# Altium schematic sheet Tube_Driver.SchDoc
size A2; SheetNumber: 1; SheetTotal: 1
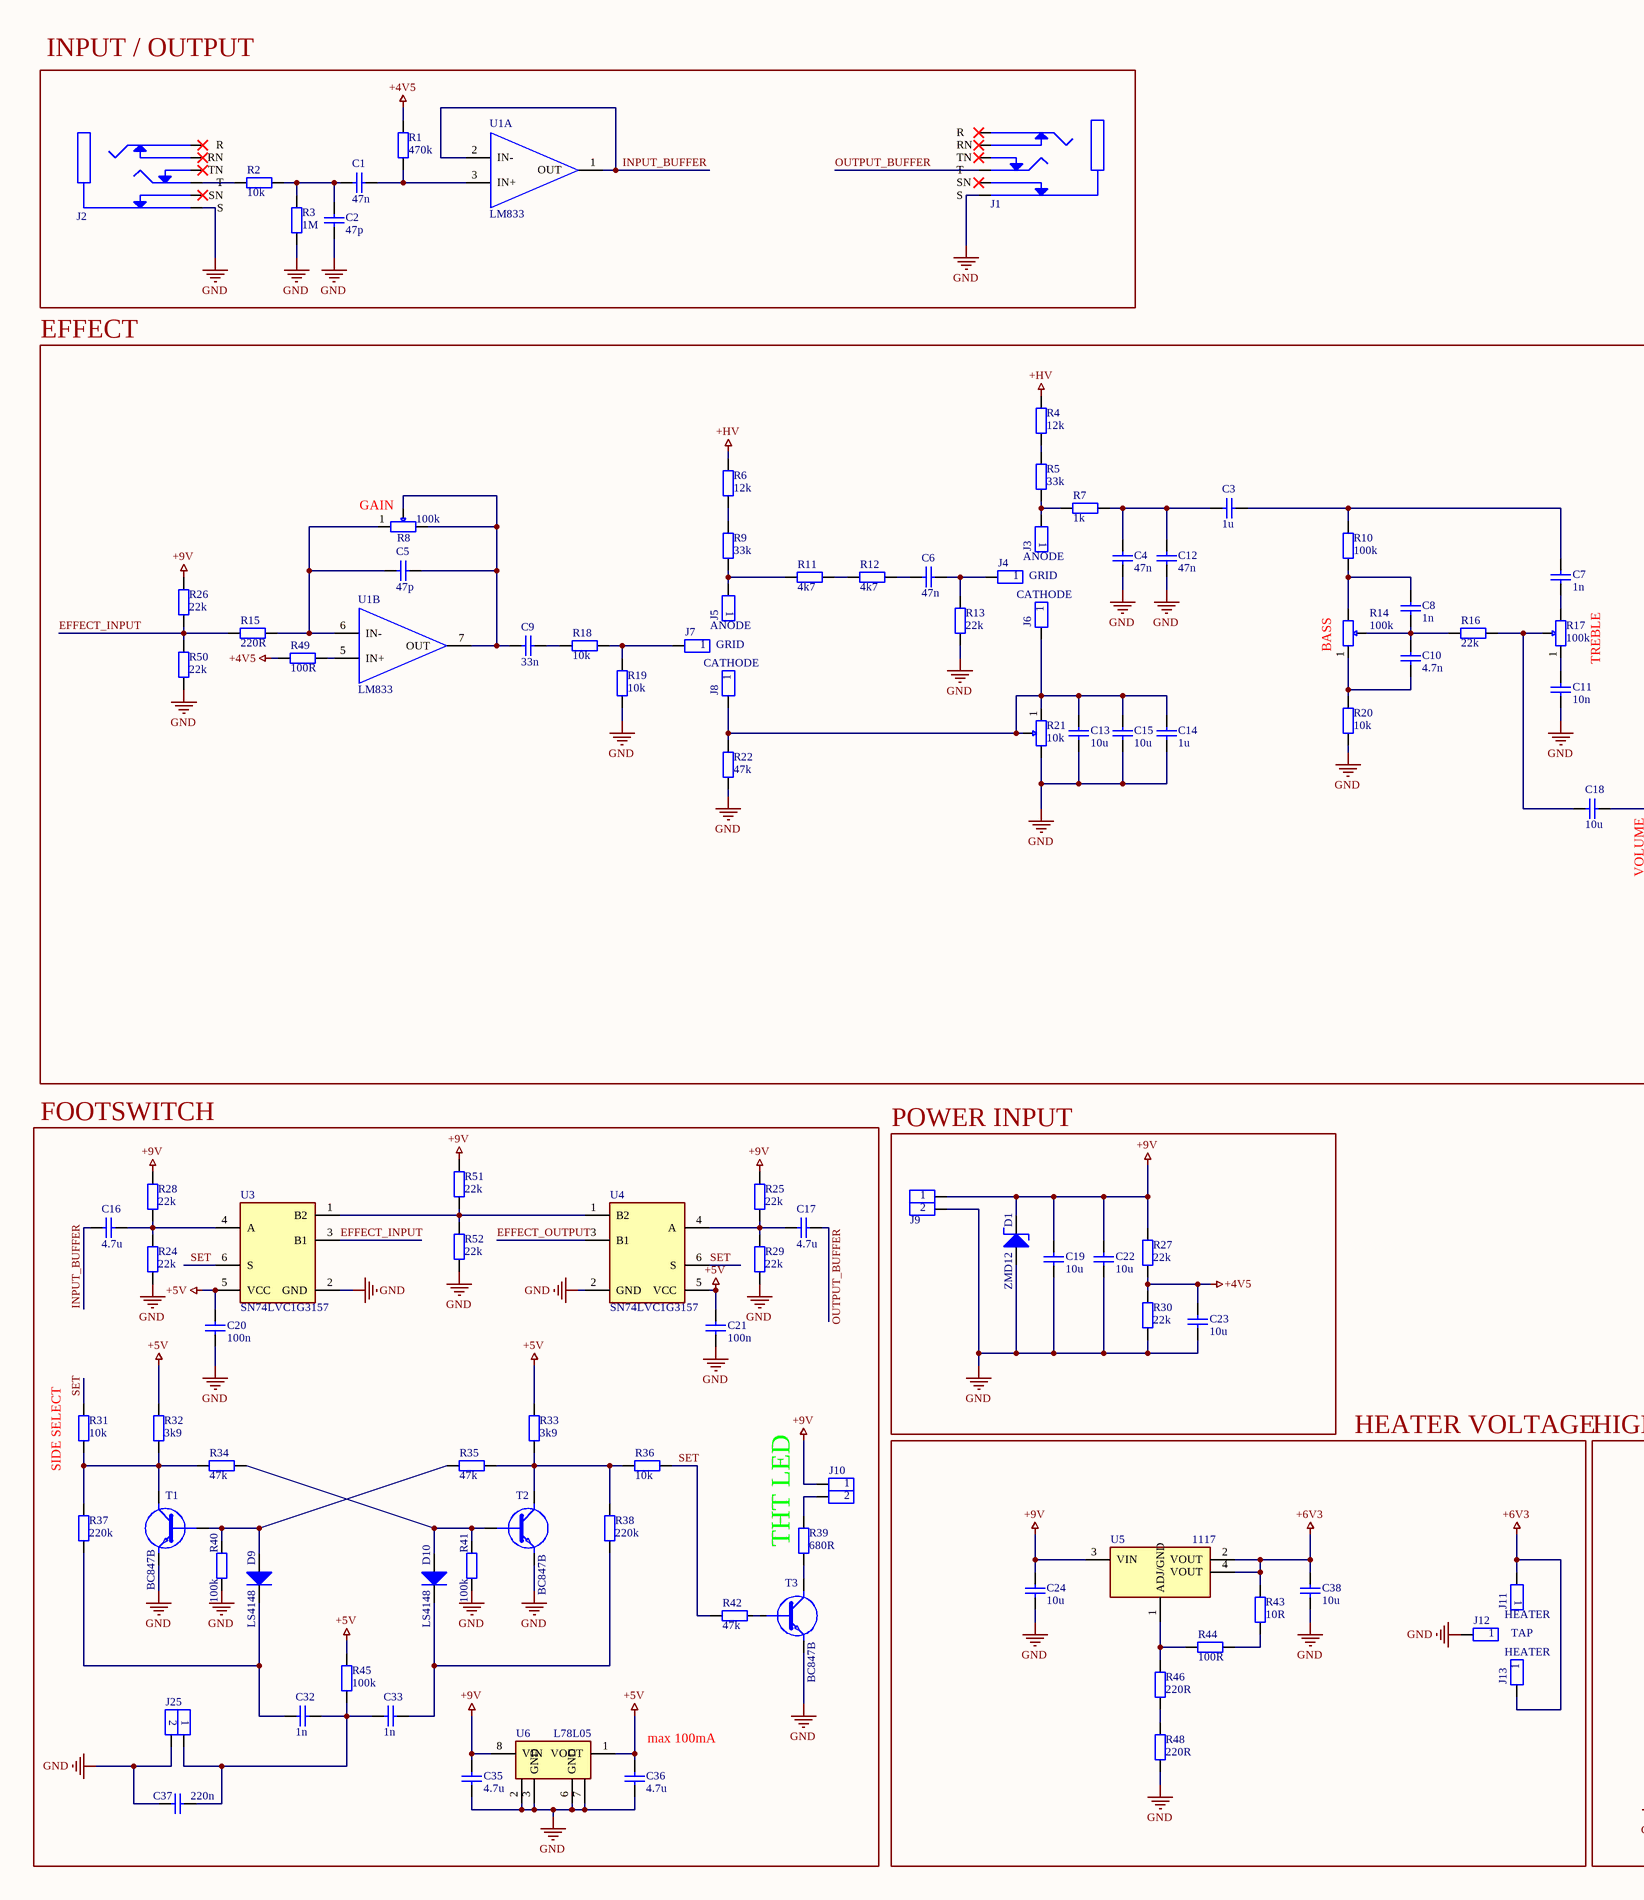
[diagram p0: Tube_Driver.SchDoc, left]
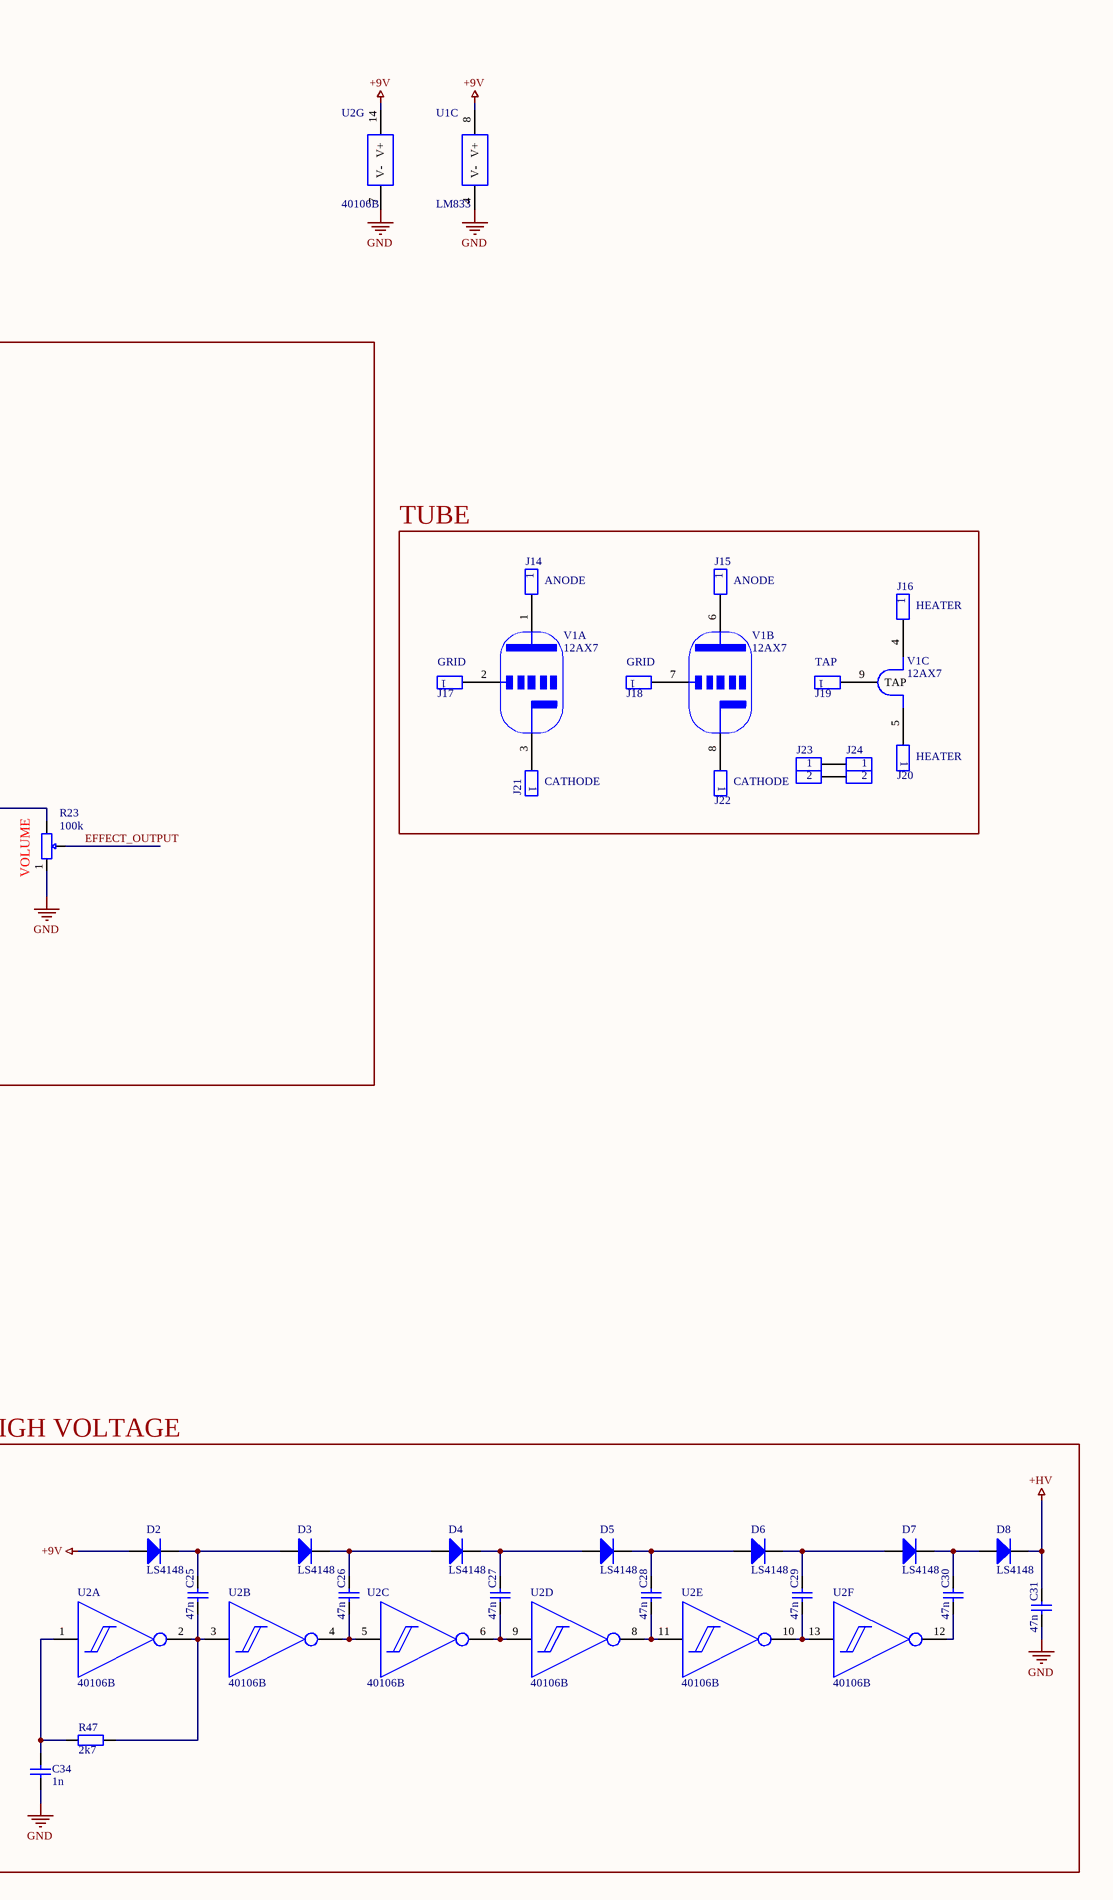
[diagram p1: Tube_Driver.SchDoc, right]

## Parts
C1  47n  [CAPACITOR 0805]
C2  47p  [CAPACITOR 0805]
C3  1u  [CAPACITOR 1206]
C4  47n  [CAPACITOR 1206]
C5  47p  [CAPACITOR 0805]
C6  47n  [CAPACITOR 1206]
C7  1n  [CAPACITOR 0805]
C8  1n  [CAPACITOR 0805]
C9  33n  [CAPACITOR 0805]
C10  4.7n  [CAPACITOR 0805]
C11  10n  [CAPACITOR 0805]
C12  47n  [CAPACITOR 1206]
C13  10u  [CAPACITOR 0805]
C14  1u  [CAPACITOR 0805]
C15  10u  [CAPACITOR 0805]
C16  4.7u  [CAPACITOR 0805]
C17  4.7u  [CAPACITOR 0805]
C18  10u  [CAPACITOR 0805]
C19  10u  [CAPACITOR 0805]
C20  100n  [CAPACITOR 0805]
C21  100n  [CAPACITOR 0805]
C22  10u  [CAPACITOR 0805]
C23  10u  [CAPACITOR 0805]
C24  10u  [CAPACITOR 0805]
C25  47n  [CAPACITOR 1206]
C26  47n  [CAPACITOR 1206]
C27  47n  [CAPACITOR 1206]
C28  47n  [CAPACITOR 1206]
C29  47n  [CAPACITOR 1206]
C30  47n  [CAPACITOR 1206]
C31  47n  [CAPACITOR 1206]
C32  1n  [CAPACITOR 0805]
C33  1n  [CAPACITOR 0805]
C34  1n  [CAPACITOR 0805]
C35  4.7u  [CAPACITOR 0805]
C36  4.7u  [CAPACITOR 0805]
C37  220n  [CAPACITOR 0805]
C38  10u  [CAPACITOR 0805]
D1  ZMD12  [DIODE SOD-80 DO-231AA]
D2  LS4148  [DIODE SOD-80 DO-231AA]
D3  LS4148  [DIODE SOD-80 DO-231AA]
D4  LS4148  [DIODE SOD-80 DO-231AA]
D5  LS4148  [DIODE SOD-80 DO-231AA]
D6  LS4148  [DIODE SOD-80 DO-231AA]
D7  LS4148  [DIODE SOD-80 DO-231AA]
D8  LS4148  [DIODE SOD-80 DO-231AA]
D9  LS4148  [DIODE SOD-80 DO-231AA]
D10  LS4148  [DIODE SOD-80 DO-231AA]
J1  ACJM-IH  [AMPHENOL ACJM-MHDR]  (value not drawn)
J2  ACJM-IH  [AMPHENOL ACJM-MHDR]  (value not drawn)
J3  901200761  [MECHANICAL PINHEADER 1P 2.54MM MALE]  (value not drawn)
J4  901200761  [MECHANICAL PINHEADER 1P 2.54MM MALE]  (value not drawn)
J5  901200761  [MECHANICAL PINHEADER 1P 2.54MM MALE]  (value not drawn)
J6  901200761  [MECHANICAL PINHEADER 1P 2.54MM MALE]  (value not drawn)
J7  901200761  [MECHANICAL PINHEADER 1P 2.54MM MALE]  (value not drawn)
J8  901200761  [MECHANICAL PINHEADER 1P 2.54MM MALE]  (value not drawn)
J9  901200762  [MECHANICAL PINHEADER 2P 2.54MM MALE]  (value not drawn)
J10  901200762  [MECHANICAL PINHEADER 2P 2.54MM MALE]  (value not drawn)
J11  901200761  [MECHANICAL PINHEADER 1P 2.54MM MALE]  (value not drawn)
J12  901200761  [MECHANICAL PINHEADER 1P 2.54MM MALE]  (value not drawn)
J13  901200761  [MECHANICAL PINHEADER 1P 2.54MM MALE]  (value not drawn)
J14  901200761  [MECHANICAL PINHEADER 1P 2.54MM MALE]  (value not drawn)
J15  901200761  [MECHANICAL PINHEADER 1P 2.54MM MALE]  (value not drawn)
J16  901200761  [MECHANICAL PINHEADER 1P 2.54MM MALE]  (value not drawn)
J17  901200761  [MECHANICAL PINHEADER 1P 2.54MM MALE]  (value not drawn)
J18  901200761  [MECHANICAL PINHEADER 1P 2.54MM MALE]  (value not drawn)
J19  901200761  [MECHANICAL PINHEADER 1P 2.54MM MALE]  (value not drawn)
J20  901200761  [MECHANICAL PINHEADER 1P 2.54MM MALE]  (value not drawn)
J21  901200761  [MECHANICAL PINHEADER 1P 2.54MM MALE]  (value not drawn)
J22  901200761  [MECHANICAL PINHEADER 1P 2.54MM MALE]  (value not drawn)
J23  901200762  [MECHANICAL PINHEADER 2P 2.54MM MALE]  (value not drawn)
J24  901200762  [MECHANICAL PINHEADER 2P 2.54MM MALE]  (value not drawn)
J25  901200762  [MECHANICAL PINHEADER 2P 2.54MM MALE]  (value not drawn)
R1  470k  [RESISTOR 0805]
R2  10k  [RESISTOR 0805]
R3  1M  [RESISTOR 0805]
R4  12k  [RESISTOR 0805]
R5  33k  [RESISTOR 0805]
R6  12k  [RESISTOR 0805]
R7  1k  [RESISTOR 0805]
R8  100k  [POTENTIOMETER PTV09A]
R9  33k  [RESISTOR 0805]
R10  100k  [RESISTOR 0805]
R11  4k7  [RESISTOR 0805]
R12  4k7  [RESISTOR 0805]
R13  22k  [RESISTOR 0805]
R14  100k  [POTENTIOMETER PTV09A]
R15  220R  [RESISTOR 0805]
R16  22k  [RESISTOR 0805]
R17  100k  [POTENTIOMETER PTV09A]
R18  10k  [RESISTOR 0805]
R19  10k  [RESISTOR 0805]
R20  10k  [RESISTOR 0805]
R21  10k  [Potentiometer 3x3.5x1.55mm]
R22  47k  [RESISTOR 0805]
R23  100k  [POTENTIOMETER PTV09A]
R24  22k  [RESISTOR 0805]
R25  22k  [RESISTOR 0805]
R26  22k  [RESISTOR 0805]
R27  22k  [RESISTOR 0805]
R28  22k  [RESISTOR 0805]
R29  22k  [RESISTOR 0805]
R30  22k  [RESISTOR 0805]
R31  10k  [RESISTOR 0805]
R32  3k9  [RESISTOR 0805]
R33  3k9  [RESISTOR 0805]
R34  47k  [RESISTOR 0805]
R35  47k  [RESISTOR 0805]
R36  10k  [RESISTOR 0805]
R37  220k  [RESISTOR 0805]
R38  220k  [RESISTOR 0805]
R39  680R  [RESISTOR 0805]
R40  100k  [RESISTOR 0805]
R41  100k  [RESISTOR 0805]
R42  47k  [RESISTOR 0805]
R43  10R  [RESISTOR 0805]
R44  100R  [RESISTOR 0805]
R45  100k  [RESISTOR 0805]
R46  220R  [RESISTOR 0805]
R47  2k7  [RESISTOR 0805]
R48  220R  [RESISTOR 0805]
R49  100R  [RESISTOR 0805]
R50  22k  [RESISTOR 0805]
R51  22k  [RESISTOR 0805]
R52  22k  [RESISTOR 0805]
T1  BC847B  [SOT23-3]
T2  BC847B  [SOT23-3]
T3  BC847B  [SOT23-3]
U1  LM833  [SOIC-8]  (parts A,B,C of 3)
U2  40106B  [SOIC-14]  (parts A,B,C,D,E,F,G of 7)
U3  SN74LVC1G3157  [SOT23-6]
U4  SN74LVC1G3157  [SOT23-6]
U5  1117  [SOT223]
U6  L78L05  [SOIC-8]
V1  12AX7  [TUbe 9pin NOVAL]  (parts A,B,C of 3)

## Blocks framed on the sheet
INPUT / OUTPUT: C1 C2 J1 J2 R1-R3 U1
EFFECT: C3-C15 C18 J3-J8 R4-R23 R26 R49 R50 U1
TUBE: J14-J24 V1
POWER INPUT: C19 C22 C23 D1 J9 R27 R30
HEATER VOLTAGE: C24 C38 J11-J13 R43 R44 R46 R48 U5
HIGH VOLTAGE: C25-C31 C34 D2-D8 R47 U2

## Nets
+4V5: C23.2 R1.2 R27.1 R30.2 R49.1
+5V: C20.2 C21.2 C36.2 R32.2 R33.2 R45.2 U3.5(VCC) U4.5(VCC) U6.1(VOUT)
+6V3: C38.2 J11.1 J13.1 R43.2 U5.2(VOUT) U5.4(VOUT)
+9V: C19.2 C22.2 C24.2 C35.2 D1.2 D2.1 J9.1 J10.1 R25.2 R26.2 R27.2 R28.2 R51.2 U1.8(V+) U2.14(V+) U5.3(VIN) U6.8(VIN)
+HV: C31.2 D8.2 R4.2 R6.2
GND: C2.1 C4.1 C11.1 C12.1 C13.1 C14.1 C15.1 C19.1 C20.1 C21.1 C22.1 C23.1 C24.1 C31.1 C34.1 C35.1 C36.1 C37.1 C38.1 D1.1 J1.1(S) J2.1(S) J9.2 J12.1 J25.2 R3.2 R13.1 R19.1 R20.1 R21.3 R22.1 R23.1 R24.1 R29.1 R30.1 R40.1 R41.1 R48.1 R50.1 R52.1 T1.2(E) T2.2(E) T3.2(E) U1.4(V-) U2.7(V-) U3.2(GND) U4.2(GND) U6.2(GND) U6.3(GND) U6.6(GND) U6.7(GND)
EFFECT_INPUT: R15.1 R26.1 R50.2 U3.3(B1)
EFFECT_OUTPUT: R23.2 U4.3(B1)
INPUT_BUFFER: C16.1 U1.1(OUT) U1.2(IN-)
OUTPUT_BUFFER: C17.2 J1.3(T)
SET: R31.2 R36.2 R42.1 U3.6(S) U4.6(S)
NetC1_1: C1.1 C2.2 R2.2 R3.1
NetC1_2: C1.2 R1.1 U1.3(IN+)
NetC3_1: C3.1 C4.2 C12.2 R7.2
NetC3_2: C3.2 C7.2 R10.2
NetC5_1: C5.1 C9.1 R8.2 R8.3 U1.7(OUT)
NetC5_2: C5.2 R8.1 R15.2 U1.6(IN-)
NetC6_1: C6.1 R12.2
NetC6_2: C6.2 J4.1 R13.2
NetC7_1: C7.1 R17.3
NetC8_1: C8.1 C10.2 R14.2 R16.1
NetC8_2: C8.2 R10.1 R14.3
NetC9_2: C9.2 R18.1
NetC10_1: C10.1 R14.1 R20.2
NetC11_2: C11.2 R17.1
NetC13_2: C13.2 C14.2 C15.2 J6.1 J8.1 R21.1 R21.2 R22.2
NetC16_2: C16.2 R24.2 R28.1 U3.4(A)
NetC17_1: C17.1 R25.1 R29.2 U4.4(A)
NetC18_1: C18.1 R23.3
NetC18_2: C18.2 R16.2 R17.2
NetC25_1: C25.1 R47.2 U2.2(~{A}) U2.3(B)
NetC25_2: C25.2 D2.2 D3.1
NetC26_1: C26.1 U2.4(~{B}) U2.5(C)
NetC26_2: C26.2 D3.2 D4.1
NetC27_1: C27.1 U2.6(~{C}) U2.9(D)
NetC27_2: C27.2 D4.2 D5.1
NetC28_1: C28.1 U2.8(~{D}) U2.11(E)
NetC28_2: C28.2 D5.2 D6.1
NetC29_1: C29.1 U2.10(~{E}) U2.13(F)
NetC29_2: C29.2 D6.2 D7.1
NetC30_1: C30.1 U2.12(~{F})
NetC30_2: C30.2 D7.2 D8.1
NetC32_1: C32.1 D9.2 R37.1
NetC32_2: C32.2 C33.1 C37.2 J25.1 R45.1
NetC33_2: C33.2 D10.2 R38.1
NetC34_2: C34.2 R47.1 U2.1(A)
NetD9_1: D9.1 R35.1 R40.2 T1.1(B)
NetD10_1: D10.1 R34.2 R41.2 T2.1(B)
NetJ2_3: J2.3(T) R2.1
NetJ3_1: J3.1 R5.1 R7.1
NetJ5_1: J5.1 R9.1 R11.1
NetJ7_1: J7.1 R18.2 R19.2
NetJ10_2: J10.2 R39.2
NetJ14_1: J14.1 V1.1(PLATE2)
NetJ15_1: J15.1 V1.6(PLATE1)
NetJ16_1: J16.1 V1.4(FIL1)
NetJ17_1: J17.1 V1.2(GRID2)
NetJ18_1: J18.1 V1.7(GRID1)
NetJ19_1: J19.1 V1.9(TAP)
NetJ20_1: J20.1 V1.5(FIL2)
NetJ21_1: J21.1 V1.3(CATHODE2)
NetJ22_1: J22.1 V1.8(CATHODE1)
NetJ23_1: J23.1 J24.1
NetJ23_2: J23.2 J24.2
NetR4_1: R4.1 R5.2
NetR6_1: R6.1 R9.2
NetR11_2: R11.2 R12.1
NetR31_1: R31.1 R32.1 R34.1 R37.2 T1.3(C)
NetR33_1: R33.1 R35.2 R36.1 R38.2 T2.3(C)
NetR39_1: R39.1 T3.3(C)
NetR42_2: R42.2 T3.1(B)
NetR43_1: R43.1 R44.2
NetR44_1: R44.1 R46.2 U5.1(ADJ/GND)
NetR46_1: R46.1 R48.2
NetR49_2: R49.2 U1.5(IN+)
NetR51_1: R51.1 R52.2 U3.1(B2) U4.1(B2)

Not connected (* = marked no-connect by the designer): J1 2(R)* 4(TN)* 5(RN)* 6(SN)*; J2 2(R)* 4(TN)* 5(RN)* 6(SN)*

## Notes on the sheet
- (near R8) GAIN
- ANODE
- GRID
- (near J14) ANODE
- (near J15) ANODE
- CATHODE
- (near J16) HEATER
- (near R14) BASS
- TREBLE
- (near J17) GRID
- (near J18) GRID
- (near J19) TAP
- (near J20) HEATER
- (near J21) CATHODE
- (near J22) CATHODE
- (near R23) VOLUME
- FOOTSWITCH
- (near R31) SIDE SELECT
- (near R39) THT LED
- HEATER
- TAP
- (near C36) max 100mA

## Library data of the parts
C1 = Capacitor 47n 0805 ±10% SMD E6: Capacitor: ceramic; MLCC; 47nF; 50V; X7R; ±10%; SMD; 0805; Manufacturer: YAGEO; Manufacturer Part Number: CC0805KRX7R9BB473; Type: Ceramic Capacitor; ComponentLink1Description: Datasheet; ComponentLink1URL: https://www.tme.eu/Document/04f8372e9ba78fa4699feb147e4488d1/UPY-GP_NP0_16V-to-50V_18.pdf; Supplier: TME; Supplier Part Number: CC0805KRX7R9473; Footprint: Capacitor 0805; Value: 47n; Tolerance: ±10%; Dielectric: X7R; Voltage max: 50V
C2 C5 = Capacitor 47p 0805 ±5% SMD E6: Capacitor: ceramic; MLCC; 47pF; 50V; C0G (NP0); ±5%; SMD; 0805; Manufacturer: YAGEO; Manufacturer Part Number: CC0805JRNPO9BN470; Type: Ceramic Capacitor; ComponentLink1Description: Datasheet; ComponentLink1URL: https://www.tme.eu/Document/04f8372e9ba78fa4699feb147e4488d1/UPY-GP_NP0_16V-to-50V_18.pdf; Supplier: TME; Supplier Part Number: CC0805JRNPO9470; Footprint: Capacitor 0805; Value: 47p; Tolerance: ±5%; Dielectric: C0G (NP0); Voltage max: 50V
C3 = Capacitor 1u 1206 ±5% SMD E6: Capacitor: ceramic; MLCC; 1uF; 100V; X7R; ±10%; SMD; 1206; Manufacturer: WALSIN; Manufacturer Part Number: 1206B105K101CT; Type: Ceramic Capacitor; ComponentLink1Description: Datasheet; ComponentLink1URL: https://www.tme.eu/Document/e45476bf270793f696988c4e93ce1237/ASC_General_Purpose.pdf; Supplier: TME; Supplier Part Number: 1206B105K101CT; Footprint: Capacitor 1206; Value: 1u; Tolerance: ±10%; Dielectric: X7R; Voltage max: 100V
C4 C6 C12 C25-C31 = Capacitor 47n 1206 ±10% SMD E6: Capacitor: ceramic; MLCC; 47nF; 100V; X7R; ±10%; SMD; 1206; Manufacturer: YAGEO; Manufacturer Part Number: CC1206KRX7R0BB473; Type: Ceramic Capacitor; ComponentLink1Description: Datasheet; ComponentLink1URL: https://www.tme.eu/Document/fbb9415081fcefba62c0f8bbf5b21210/UPY-GPHC_X7R_6.3V-to-50V_20.pdf; Supplier: TME; Supplier Part Number: CC1206KRX7R0BB473; Footprint: Capacitor 1206; Value: 47n; Tolerance: ±10%; Dielectric: X7R; Voltage max: 100V
C7 C8 C32-C34 = Capacitor 1n 0805 ±10% SMD E6: Capacitor: ceramic; MLCC; 1nF; 50V; X7R; ±10%; SMD; 0805; Manufacturer: YAGEO; Manufacturer Part Number: CC0805KRX7R9BB102; Type: Ceramic Capacitor; ComponentLink1Description: Datasheet; ComponentLink1URL: https://www.tme.eu/Document/04f8372e9ba78fa4699feb147e4488d1/UPY-GP_NP0_16V-to-50V_18.pdf; Supplier: TME; Supplier Part Number: CC0805KRX7R9102; Footprint: Capacitor 0805; Value: 1n; Tolerance: ±10%; Dielectric: X7R; Voltage max: 50V
C9 = Capacitor 33n 0805 ±10% SMD E6: Capacitor: ceramic; MLCC; 33nF; 50V; X7R; ±10%; SMD; 0805; Manufacturer: YAGEO; Manufacturer Part Number: CC0805KRX7R9BB333; Type: Ceramic Capacitor; ComponentLink1Description: Datasheet; ComponentLink1URL: https://www.tme.eu/Document/04f8372e9ba78fa4699feb147e4488d1/UPY-GP_NP0_16V-to-50V_18.pdf; Supplier: TME; Supplier Part Number: CC0805KRX7R9333; Footprint: Capacitor 0805; Value: 33n; Tolerance: ±10%; Dielectric: X7R; Voltage max: 50V
C10 = Capacitor 4n7 0805 ±10% SMD E6: Capacitor: ceramic; MLCC; 4.7nF; 50V; X7R; ±10%; SMD; 0805; Manufacturer: YAGEO; Manufacturer Part Number: CC0805KRX7R9BB472; Type: Ceramic Capacitor; ComponentLink1Description: Datasheet; ComponentLink1URL: https://www.tme.eu/Document/04f8372e9ba78fa4699feb147e4488d1/UPY-GP_NP0_16V-to-50V_18.pdf; Supplier: TME; Supplier Part Number: CC0805KRX7R9472; Footprint: Capacitor 0805; Value: 4.7n; Tolerance: ±10%; Dielectric: X7R; Voltage max: 50V
C11 = Capacitor 10n 0805 ±10% SMD E6: Capacitor: ceramic; MLCC; 10nF; 50V; X7R; ±10%; SMD; 0805; Manufacturer: YAGEO; Manufacturer Part Number: CC0805KRX7R9BB103; Type: Ceramic Capacitor; ComponentLink1Description: Datasheet; ComponentLink1URL: https://www.tme.eu/Document/04f8372e9ba78fa4699feb147e4488d1/UPY-GP_NP0_16V-to-50V_18.pdf; Supplier: TME; Supplier Part Number: CC0805KRX7R9103; Footprint: Capacitor 0805; Value: 10n; Tolerance: ±10%; Dielectric: X7R; Voltage max: 50V
C13 C15 C18 C19 C22-C24 C38 = Capacitor 10u 0805 ±10% SMD E3: Capacitor: ceramic; MLCC; 10uF; 25V; X5R; ±10%; SMD; 0805; Manufacturer: MURATA; Manufacturer Part Number: GRJ21BR61E106KE01K; Type: Ceramic Capacitor; ComponentLink1Description: Datasheet; ComponentLink1URL: https://www.tme.eu/Document/58bb7db4269ac3ad53d1aa3c0ade9bab/GRM.pdf; Supplier: TME; Supplier Part Number: GRJ21BR61E106KE01K; Footprint: Capacitor 0805; Value: 10u; Tolerance: ±10%; Dielectric: X5R; Voltage max: 25V
C14 = Capacitor 1u 0805 ±10% SMD E3: Capacitor: ceramic; MLCC; 1uF; 16V; X7R; ±10%; SMD; 0805; Manufacturer: YAGEO; Manufacturer Part Number: CC0805KKX7R7BB105; Type: Ceramic Capacitor; ComponentLink1Description: Datasheet; ComponentLink1URL: https://www.tme.eu/Document/071099429b2f0d2eb6856bd75496057a/CC0603KRX7R9BB1228324192.pdf; Supplier: TME; Supplier Part Number: CC0805KKX7R7105; Footprint: Capacitor 0805; Value: 1u; Tolerance: ±10%; Dielectric: X7R; Voltage max: 16V
C16 C17 C35 C36 = Capacitor 4u7 0805 ±10% SMD E3: Capacitor: ceramic; MLCC; 4.7uF; 16V; X7R; ±10%; SMD; 0805; Manufacturer: YAGEO; Manufacturer Part Number: CC0805KKX7R7BB475; Type: Ceramic Capacitor; ComponentLink1Description: Datasheet; ComponentLink1URL: https://www.tme.eu/Document/071099429b2f0d2eb6856bd75496057a/CC0603KRX7R9BB1228324192.pdf; Supplier: TME; Supplier Part Number: CC0805KKX7R7BB475; Footprint: Capacitor 0805; Value: 4.7u; Tolerance: ±10%; Dielectric: X7R; Voltage max: 16V
C20 C21 = Capacitor 100n 0805 ±10% SMD E6: Capacitor: ceramic; MLCC; 100nF; 50V; X7R; ±10%; SMD; 0805; Manufacturer: YAGEO; Manufacturer Part Number: CC0805KRX7R9BB104; Type: Ceramic Capacitor; ComponentLink1Description: Datasheet; ComponentLink1URL: https://www.tme.eu/Document/04f8372e9ba78fa4699feb147e4488d1/UPY-GP_NP0_16V-to-50V_18.pdf; Supplier: TME; Supplier Part Number: CC0805KRX7R9104; Footprint: Capacitor 0805; Value: 100n; Tolerance: ±10%; Dielectric: X7R; Voltage max: 50V
C37 = Capacitor 220n 0805 ±10% SMD E6: Capacitor: ceramic; MLCC; 220nF; 50V; X7R; ±10%; SMD; 0805; Manufacturer: YAGEO; Manufacturer Part Number: CC0805KKX7R9BB224; Type: Ceramic Capacitor; ComponentLink1Description: Datasheet; ComponentLink1URL: https://www.tme.eu/Document/04f8372e9ba78fa4699feb147e4488d1/UPY-GP_NP0_16V-to-50V_18.pdf; Supplier: TME; Supplier Part Number: CC0805KKX7R9224; Footprint: Capacitor 0805; Value: 220n; Tolerance: ±10%; Dielectric: X7R; Voltage max: 50V
D1 = Diode 12V 1W SOD80 Zener ZMD12: Diode: Zener; 1W; 12V; SMD; reel,tape; MiniMELF plastic; Manufacturer: DIOTEC SEMICONDUCTOR; Type: Zener Diode; Forward Voltage: 1V; ComponentLink1Description: Datasheet; ComponentLink1URL: https://www.tme.eu/Document/9a1c7317052d9f9e9799c606dfc1c6e5/ls4148.pdf; Manufacturer Part Number: ZMD12; Supplier: TME; Supplier Part Number: ZMD12-DIO; Value: ZMD12; Power: 1W; Reverse Voltage: 12V
D2-D10 = Diode 100V 0.15A SOD80 General Purpose LL4148: Diode: switching; SMD; 100V; 0.15A; 4ns; MiniMELF quadro; Ufmax: 1V; Manufacturer: DIOTEC SEMICONDUCTOR; Type: Switching Diode; ComponentLink1Description: Datasheet; Manufacturer Part Number: LS4148; Supplier: TME; Supplier Part Number: LS4148-DIO; Value: LS4148; Forward Voltage: 1V; Current: 0.15A; Reverse Voltage: 100V
  D2-D8: ComponentLink1URL: https://www.tme.eu/Document/9a1c7317052d9f9e9799c606dfc1c6e5/ls4148.pdf
  D9 D10: ComponentLink1URL: https://www.tme.eu/Document/666c7f44a829e216c7a9f68285ef4f7d/PYu-RC_Group_51_RoHS_L_11.pdf
J1 J2 = Mechanical Jack 6.3mm Socket PCB THT ACJM-MHDR: Socket; Jack 6,3mm; female; mono,with double switch; ways: 2; THT; Manufacturer: AMPHENOL; ComponentLink1Description: Datasheet; ComponentLink1URL: https://www.tme.eu/Document/3b481b31b258de2c2d440deba99f1516/ACJM-IH.pdf; Manufacturer Part Number: ACJM-IH; Supplier: TME; Supplier Part Number: ACJM-IH; Type: Jack 6.3mm; Footprint: AMPHENOL ACJM-IH; Mounting: THT; Value: ACJM-IH
J3-J8 J11-J22 = Mechanical Pinheader Male 1pin P=2.54mm THT: Pin header; pin strips; C-Grid III; male; PIN: 1; straight; 2.54mm; Manufacturer: MOLEX; Current: 3A; ComponentLink1Description: Datasheet; ComponentLink1URL: https://www.tme.eu/Document/5abee1dba4fd2cbb64da0ee0ca93f477/MX-90120-0762.pdf; Manufacturer Part Number: 901200761; Supplier: TME; Supplier Part Number: MX-90120-0761; Type: Pin Header; Mounting: THT; Pitch: 2.54 mm; Value: 901200761
J9 J10 J23-J25 = Mechanical Pinheader Male 2pin P=2.54mm THT: Pin header; pin strips; C-Grid III; male; PIN: 2; straight; 2.54mm; Manufacturer: MOLEX; Current: 3A; ComponentLink1Description: Datasheet; Manufacturer Part Number: 901200762; Supplier: TME; Supplier Part Number: MX-90120-0762; Type: Pin Header; Mounting: THT; Pitch: 2.54 mm; Value: 901200762
  J9 J25: ComponentLink1URL: https://www.tme.eu/Document/5abee1dba4fd2cbb64da0ee0ca93f477/MX-90120-0762.pdf
  J10 J23 J24: ComponentLink1URL: https://www.tme.eu/Document/9a1c7317052d9f9e9799c606dfc1c6e5/ls4148.pdf
R1 = Resistor 470k 0805 1% 0.125W SMD E12: Resistor: thick film; SMD; 0805; 470kΩ; 0,125W; ±1%; -55÷155°C; Manufacturer: YAGEO; Manufacturer Part Number: RC0805FR-07470KL; Power: 0.125W; Voltage max: 150V; ComponentLink1Description: Datasheet; ComponentLink1URL: https://www.tme.eu/Document/666c7f44a829e216c7a9f68285ef4f7d/PYu-RC_Group_51_RoHS_L_11.pdf; Supplier: TME; Supplier Part Number: RC0805FR-07470KL; Type: Thick Film Resistor; Footprint: Resistor 0805; Value: 470k; Tolerance: 1%
R2 R18-R20 R31 R36 = Resistor 10k 0805 1% 0.125W SMD E12: Resistor: thick film; SMD; 0805; 10kΩ; 0,125W; ±1%; -55÷155°C; Manufacturer: YAGEO; Manufacturer Part Number: RC0805FR-0710KL; Power: 0.125W; Voltage max: 150V; ComponentLink1Description: Datasheet; ComponentLink1URL: https://www.tme.eu/Document/666c7f44a829e216c7a9f68285ef4f7d/PYu-RC_Group_51_RoHS_L_11.pdf; Supplier: TME; Supplier Part Number: RC0805FR-0710KL; Type: Thick Film Resistor; Footprint: Resistor 0805; Value: 10k; Tolerance: 1%
R3 = Resistor 1M 0805 1% 0.125W SMD E12: Resistor: thick film; SMD; 0805; 1MΩ; 0,125W; ±1%; -55÷155°C; Manufacturer: YAGEO; Manufacturer Part Number: RC0805FR-071ML; Power: 0.125W; Voltage max: 150V; ComponentLink1Description: Datasheet; ComponentLink1URL: https://www.tme.eu/Document/666c7f44a829e216c7a9f68285ef4f7d/PYu-RC_Group_51_RoHS_L_11.pdf; Supplier: TME; Supplier Part Number: RC0805FR-071ML; Type: Thick Film Resistor; Footprint: Resistor 0805; Value: 1M; Tolerance: 1%
R4 R6 = Resistor 12k 0805 1% 0.125W SMD E12: Resistor: thick film; SMD; 0805; 12kΩ; 0,125W; ±1%; -55÷155°C; Manufacturer: YAGEO; Manufacturer Part Number: RC0805FR-0712KL; Power: 0.125W; Voltage max: 150V; ComponentLink1Description: Datasheet; ComponentLink1URL: https://www.tme.eu/Document/666c7f44a829e216c7a9f68285ef4f7d/PYu-RC_Group_51_RoHS_L_11.pdf; Supplier: TME; Supplier Part Number: RC0805FR-0712KL; Type: Thick Film Resistor; Footprint: Resistor 0805; Value: 12k; Tolerance: 1%
R5 R9 = Resistor 33k 0805 1% 0.125W SMD E12: Resistor: thick film; SMD; 0805; 33kΩ; 0,125W; ±1%; -55÷155°C; Manufacturer: YAGEO; Manufacturer Part Number: RC0805FR-0733KL; Power: 0.125W; Voltage max: 150V; ComponentLink1Description: Datasheet; ComponentLink1URL: https://www.tme.eu/Document/666c7f44a829e216c7a9f68285ef4f7d/PYu-RC_Group_51_RoHS_L_11.pdf; Supplier: TME; Supplier Part Number: RC0805FR-0733KL; Type: Thick Film Resistor; Footprint: Resistor 0805; Value: 33k; Tolerance: 1%
R7 = Resistor 1k 0805 1% 0.125W SMD E12: Resistor: thick film; SMD; 0805; 1kΩ; 0,125W; ±1%; -55÷155°C; Manufacturer: YAGEO; Manufacturer Part Number: RC0805FR-071KL; Power: 0.125W; Voltage max: 150V; ComponentLink1Description: Datasheet; ComponentLink1URL: https://www.tme.eu/Document/666c7f44a829e216c7a9f68285ef4f7d/PYu-RC_Group_51_RoHS_L_11.pdf; Supplier: TME; Supplier Part Number: RC0805FR-071KL; Type: Thick Film Resistor; Footprint: Resistor 0805; Value: 1k; Tolerance: 1%
R8 R14 R17 R23 = Potentiometer PCB 100k THT Linear PTV09A: Potentiometer: shaft; single turn; 100kΩ; 125mW; ±20%; THT; 6mm; Manufacturer: SR PASSIVES; Manufacturer Part Number: R9011-1-100K; Power: 0.125W; Voltage max: 200V; Shaft length: 18mm; ComponentLink1Description: Datasheet; ComponentLink1URL: https://www.tme.eu/Document/04583ac39161600e9684e4ace74c9dee/R9011.pdf; Supplier: TME; Supplier Part Number: R9011-1-100K; Type: Single Turn Potentiometer; Value: 100k; Tolerance: 20%; Shaft diameter: 6mm
R10 R40 R41 R45 = Resistor 100k 0805 1% 0.125W SMD E12: Resistor: thick film; SMD; 0805; 100kΩ; 0,125W; ±1%; -55÷155°C; Manufacturer: YAGEO; Manufacturer Part Number: RC0805FR-07100KL; Power: 0.125W; Voltage max: 150V; ComponentLink1Description: Datasheet; ComponentLink1URL: https://www.tme.eu/Document/666c7f44a829e216c7a9f68285ef4f7d/PYu-RC_Group_51_RoHS_L_11.pdf; Supplier: TME; Supplier Part Number: RC0805FR-07100KL; Type: Thick Film Resistor; Footprint: Resistor 0805; Value: 100k; Tolerance: 1%
R11 R12 = Resistor 4k7 0805 1% 0.125W SMD E12: Resistor: thick film; SMD; 0805; 4.7kΩ; 0,125W; ±1%; -55÷155°C; Manufacturer: YAGEO; Manufacturer Part Number: RC0805FR-074K7L; Power: 0.125W; Voltage max: 150V; ComponentLink1Description: Datasheet; ComponentLink1URL: https://www.tme.eu/Document/666c7f44a829e216c7a9f68285ef4f7d/PYu-RC_Group_51_RoHS_L_11.pdf; Supplier: TME; Supplier Part Number: RC0805FR-074K7L; Type: Thick Film Resistor; Footprint: Resistor 0805; Value: 4k7; Tolerance: 1%
R13 R16 R24-R30 R50-R52 = Resistor 22k 0805 1% 0.125W SMD E12: Resistor: thick film; SMD; 0805; 22kΩ; 0,125W; ±1%; -55÷155°C; Manufacturer: YAGEO; Manufacturer Part Number: RC0805FR-0722KL; Power: 0.125W; Voltage max: 150V; ComponentLink1Description: Datasheet; ComponentLink1URL: https://www.tme.eu/Document/666c7f44a829e216c7a9f68285ef4f7d/PYu-RC_Group_51_RoHS_L_11.pdf; Supplier: TME; Supplier Part Number: RC0805FR-0722KL; Type: Thick Film Resistor; Footprint: Resistor 0805; Value: 22k; Tolerance: 1%
R15 R46 R48 = Resistor 220R 0805 1% 0.125W SMD E12: Resistor: thick film; SMD; 0805; 220Ω; 0,125W; ±1%; -55÷155°C; Manufacturer: YAGEO; Manufacturer Part Number: RC0805FR-07220RL; Power: 0.125W; Voltage max: 150V; ComponentLink1Description: Datasheet; ComponentLink1URL: https://www.tme.eu/Document/666c7f44a829e216c7a9f68285ef4f7d/PYu-RC_Group_51_RoHS_L_11.pdf; Supplier: TME; Supplier Part Number: RC0805FR-07220RL; Type: Thick Film Resistor; Footprint: Resistor 0805; Value: 220R; Tolerance: 1%
R21 = Potentiometer 10k 25% 0.1W SMD Linear 3x3.5x1.55mm: Potentiometer: mounting; single turn; 10kΩ; 100mW; SMD; ±25%; linear; Manufacturer: SR PASSIVES; Manufacturer Part Number: 3305SMD-10K; Power: 0.1W; Voltage max: 50V; ComponentLink1Description: Datasheet; ComponentLink1URL: https://www.tme.eu/Document/8c1ff45156797735249e0c74a685b1eb/SR_PASSIVES-3305SMD.pdf; Supplier: TME; Supplier Part Number: 3305SMD-10K; Type: Single Turn Potentiometer; Value: 10k; Tolerance: 25%
R22 R34 R35 R42 = Resistor 47k 0805 1% 0.125W SMD E12: Resistor: thick film; SMD; 0805; 47kΩ; 0,125W; ±1%; -55÷155°C; Manufacturer: YAGEO; Manufacturer Part Number: RC0805FR-0747KL; Power: 0.125W; Voltage max: 150V; ComponentLink1Description: Datasheet; ComponentLink1URL: https://www.tme.eu/Document/666c7f44a829e216c7a9f68285ef4f7d/PYu-RC_Group_51_RoHS_L_11.pdf; Supplier: TME; Supplier Part Number: RC0805FR-0747KL; Type: Thick Film Resistor; Footprint: Resistor 0805; Value: 47k; Tolerance: 1%
R32 R33 = Resistor 3K9 0805 1% 0.125W SMD E12: Resistor: thick film; SMD; 0805; 3.9kΩ; 0,125W; ±1%; -55÷155°C; Manufacturer: YAGEO; Manufacturer Part Number: RC0805FR-073K9L; Power: 0.125W; Voltage max: 150V; ComponentLink1Description: Datasheet; ComponentLink1URL: https://www.tme.eu/Document/666c7f44a829e216c7a9f68285ef4f7d/PYu-RC_Group_51_RoHS_L_11.pdf; Supplier: TME; Supplier Part Number: RC0805FR-073K9L; Type: Thick Film Resistor; Footprint: Resistor 0805; Value: 3k9; Tolerance: 1%
R37 R38 = Resistor 220k 0805 1% 0.125W SMD E12: Resistor: thick film; SMD; 0805; 220kΩ; 0,125W; ±1%; -55÷155°C; Manufacturer: YAGEO; Manufacturer Part Number: RC0805FR-07220KL; Power: 0.125W; Voltage max: 150V; ComponentLink1Description: Datasheet; ComponentLink1URL: https://www.tme.eu/Document/666c7f44a829e216c7a9f68285ef4f7d/PYu-RC_Group_51_RoHS_L_11.pdf; Supplier: TME; Supplier Part Number: RC0805FR-07220KL; Type: Thick Film Resistor; Footprint: Resistor 0805; Value: 220k; Tolerance: 1%
R39 = Resistor 680R 0805 1% 0.125W SMD E12: Resistor: thick film; SMD; 0805; 680Ω; 0,125W; ±1%; -55÷155°C; Manufacturer: YAGEO; Manufacturer Part Number: RC0805FR-07680RL; Power: 0.125W; Voltage max: 150V; ComponentLink1Description: Datasheet; ComponentLink1URL: https://www.tme.eu/Document/666c7f44a829e216c7a9f68285ef4f7d/PYu-RC_Group_51_RoHS_L_11.pdf; Supplier: TME; Supplier Part Number: RC0805FR-07680RL; Type: Thick Film Resistor; Footprint: Resistor 0805; Value: 680R; Tolerance: 1%
R43 = Resistor 10R 0805 1% 0.125W SMD E12: Resistor: thick film; SMD; 0805; 10Ω; 0,125W; ±1%; -55÷155°C; Manufacturer: YAGEO; Manufacturer Part Number: RC0805FR-0710RL; Power: 0.125W; Voltage max: 150V; ComponentLink1Description: Datasheet; ComponentLink1URL: https://www.tme.eu/Document/666c7f44a829e216c7a9f68285ef4f7d/PYu-RC_Group_51_RoHS_L_11.pdf; Supplier: TME; Supplier Part Number: RC0805FR-0710RL; Type: Thick Film Resistor; Footprint: Resistor 0805; Value: 10R; Tolerance: 1%
R44 R49 = Resistor 100R 0805 1% 0.125W SMD E12: Resistor: thick film; SMD; 0805; 10Ω; 0,125W; ±1%; -55÷155°C; Manufacturer: YAGEO; Manufacturer Part Number: RC0805FR-07100RL; Power: 0.125W; Voltage max: 150V; ComponentLink1Description: Datasheet; ComponentLink1URL: https://www.tme.eu/Document/666c7f44a829e216c7a9f68285ef4f7d/PYu-RC_Group_51_RoHS_L_11.pdf; Supplier: TME; Supplier Part Number: RC0805FR-07100RL; Type: Thick Film Resistor; Footprint: Resistor 0805; Value: 100R; Tolerance: 1%
R47 = Resistor 2k7 0805 1% 0.125W SMD E12: Resistor: thick film; SMD; 0805; 2.7kΩ; 0,125W; ±1%; -55÷155°C; Manufacturer: YAGEO; Manufacturer Part Number: RC0805FR-072K7L; Power: 0.125W; Voltage max: 150V; ComponentLink1Description: Datasheet; ComponentLink1URL: https://www.tme.eu/Document/666c7f44a829e216c7a9f68285ef4f7d/PYu-RC_Group_51_RoHS_L_11.pdf; Supplier: TME; Supplier Part Number: RC0805FR-072K7L; Type: Thick Film Resistor; Footprint: Resistor 0805; Value: 2k7; Tolerance: 1%
T1-T3 = Transistor NPN 100mA 50V 0.225W BC847BLT1G: Transistor: NPN; bipolar; 50V; 0.1A; 0.225W; SOT23; Manufacturer: ONSEMI; Type: NPN Bipolar; ComponentLink1Description: Datasheet; ComponentLink1URL: https://www.tme.eu/Document/2c8d510b744f532dcc70087b56c4cf86/BC84xALT1G.PDF; Manufacturer Part Number: BC847BLT1G; Supplier: TME; Supplier Part Number: BC847BLT1G; Current: 0.1A; Voltage: 50V; Power: 0.225W; Value: BC847B
U1 = IC Op-Amp Dual LM833DT SOIC-8: Audio Amplifiers SOIC8 5-36V 15MHz LM833; Manufacturer: STMicroelectronics; Voltage: 5..30; ComponentLink1Description: Datasheet; ComponentLink1URL: https://www.tme.eu/Document/4352da687a2f4b9e1ad18d9b547c2277/LM833DT.pdf; Manufacturer Part Number: LM833DT; Supplier: TME; Supplier Part Number: LM833DT; Type: Operational Amplifier; Value: LM833; Bandwidth: 15 MHz
U2 = IC Gate NOT Schmitt 6CH SOIC14: IC: digital; NOT; Ch: 6; IN: 1; CMOS; SMD; SOIC14; 3÷18VDC; -55÷125°C; Manufacturer: TEXAS INSTRUMENTS; Manufacturer Part Number: LM833DT; Value: LM833; Bandwidth: 15 MHz; Voltage: 5..30; ComponentLink1Description: Datasheet; ComponentLink1URL: https://www.tme.eu/Document/4352da687a2f4b9e1ad18d9b547c2277/LM833DT.pdf; Footprint: SOIC-8; Supplier: TME; Supplier Part Number: LM833DT; Type: Operational Amplifier
U3 U4 = IC SPDT Analog Switch SOT-23-6 SN74LVC1G3157DBVR: IC: analog switch; SPDT; Ch: 1; SOT23-6; 1.65÷5.5VDC; Manufacturer: TEXAS INSTRUMENTS; Voltage: 1.65..5.5; Current: 0.1A; ComponentLink1Description: Datasheet; ComponentLink1URL: https://www.ti.com/lit/gpn/sn74lvc1g3157; Manufacturer Part Number: SN74LVC1G3157DBVR; Supplier: TME; Supplier Part Number: SN74LVC1G3157DBVR; Type: Analog Switch; Value: SN74LVC1G3157
U5 = IC LDO ADJ 1A SOT223 SMD LDI1117: IC: voltage regulator; LDO,linear,adjustable; 1.25÷13.65V; 1A; Manufacturer: DIOTEC SEMICONDUCTOR; Manufacturer Part Number: LDI1117-ADH; Input Voltage: 1.25..13.65; ComponentLink1Description: Datasheet; ComponentLink1URL: https://www.tme.eu/Document/084a5eb18462203f10c4803bc35208f3/ldi1117h.pdf; Supplier: TME; Supplier Part Number: LDI1117-ADH-DIO; Type: LDO ADJ; Value: 1117; Current: 1A
U6 = IC LDO 5V 0.1A SO8 SMD L78L05CD13TR: IC: voltage regulator; linear,fixed; 5V; 0.1A; SO8; SMD; reel,tape; Manufacturer: STMicroelectronics; Input Voltage: 7..20; ComponentLink1Description: Datasheet; ComponentLink1URL: https://www.tme.eu/Document/556d763f6e3aa84c6e4929a4d8f94277/L78Lxx.pdf; Manufacturer Part Number: L78L05CD13TR; Supplier: TME; Supplier Part Number: L78L05CD13TR; Type: LDO; Value: L78L05; Current: 0.1A
V1 = Tube 12AX7 / ECC83 9pin NOVAL